# EAGLE design V2.0 (EAGLE 9.6.2)
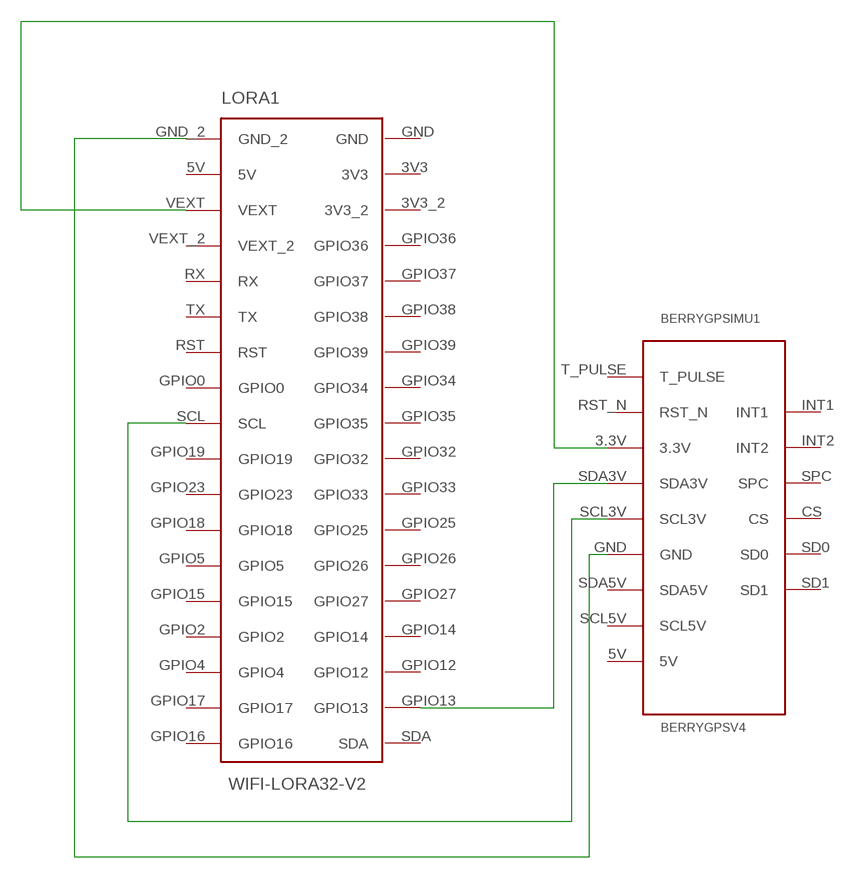
[diagram p0: schematic, sheet 1]

## Parts
BERRYGPSIMU1  BERRYGPSV4  [BERRYGPSV4]
LORA1  WIFI-LORA32-V2  [WIFI-LORA32-V2]

## Nets
N$1: BERRYGPSIMU1.SDA3V LORA1.GPIO13
N$2: BERRYGPSIMU1.SCL3V LORA1.SCL
N$3: BERRYGPSIMU1.GND LORA1.GND_2
N$4: BERRYGPSIMU1.3.3V LORA1.VEXT
Unconnected: BERRYGPSIMU1.5V BERRYGPSIMU1.CS BERRYGPSIMU1.INT1 BERRYGPSIMU1.INT2 BERRYGPSIMU1.RST_N BERRYGPSIMU1.SCL5V BERRYGPSIMU1.SD0 BERRYGPSIMU1.SD1 BERRYGPSIMU1.SDA5V BERRYGPSIMU1.SPC BERRYGPSIMU1.T_PULSE LORA1.3V3 LORA1.3V3_2 LORA1.5V LORA1.GND LORA1.GPIO0 LORA1.GPIO2 LORA1.GPIO4 LORA1.GPIO5 LORA1.GPIO12 LORA1.GPIO14 LORA1.GPIO15 LORA1.GPIO16 LORA1.GPIO17 LORA1.GPIO18 LORA1.GPIO19 LORA1.GPIO23 LORA1.GPIO25 LORA1.GPIO26 LORA1.GPIO27 LORA1.GPIO32 LORA1.GPIO33 LORA1.GPIO34 LORA1.GPIO35 LORA1.GPIO36 LORA1.GPIO37 LORA1.GPIO38 LORA1.GPIO39 LORA1.RST LORA1.RX LORA1.SDA LORA1.TX LORA1.VEXT_2

## Library data of the parts
BERRYGPSIMU1 = berrygpsv4:BERRYGPSV4: BerryGPS-IMU v4 has been designed to fit perfectly with the Raspberry Pi Zero. It is also compatible with all other versions of the Raspberry Pi and Arduino.
LORA1 = wifilora32v2:WIFI-LORA32-V2

## Board
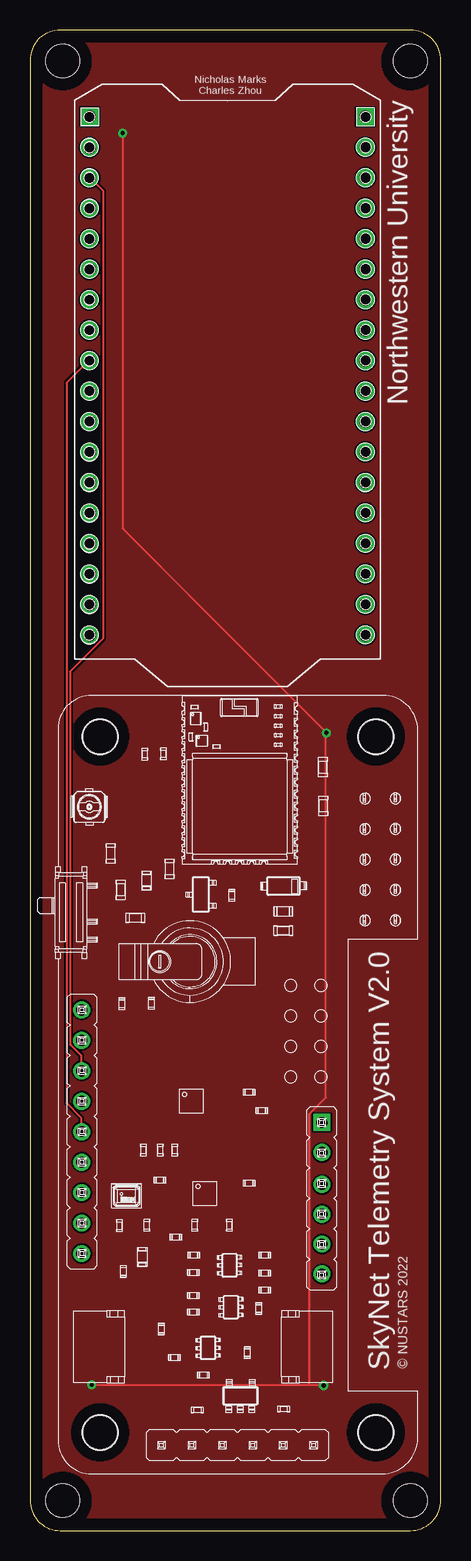
[diagram p1: board, top side]
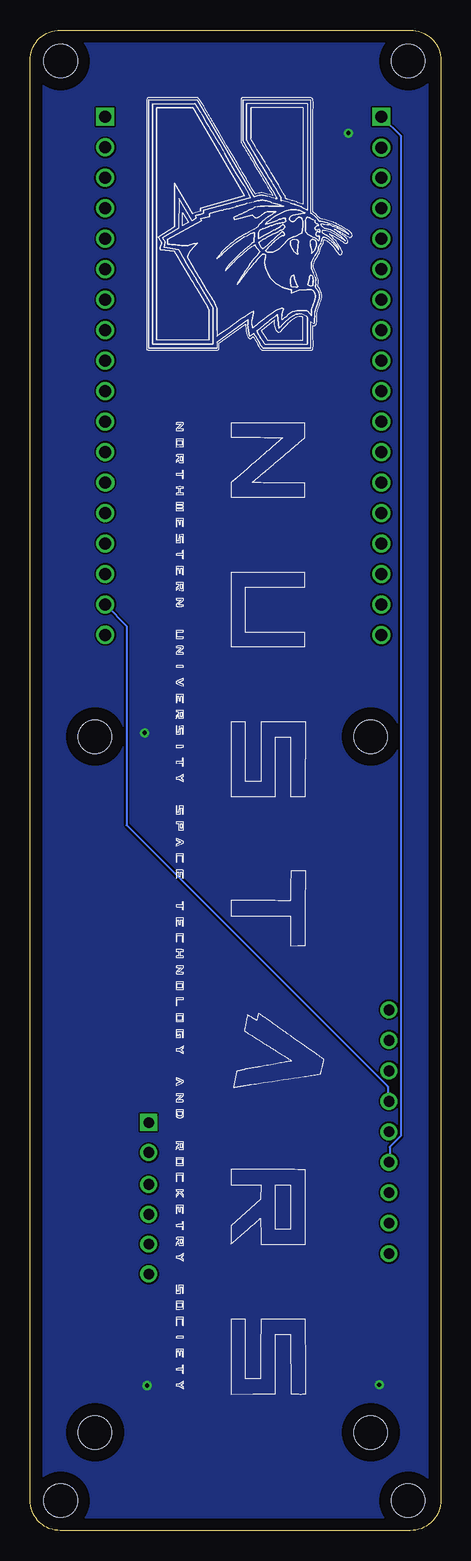
[diagram p2: board, bottom side, seen from below]

Size 34.27 x 125.09 mm. Coordinates in mm from the lower left corner, seen from the top.
Outline: 0,122.55 0,2.54 arc90 2.54,0 31.73,0 arc90 34.27,2.54 34.27,122.55 arc90 31.73,125.09 2.54,125.09 arc90 0,122.55
Copper layers (1*16): Top 0.035mm / dielectric 1.5mm / Bottom 0.035mm
Design rules "default": minimum track width 6mil, minimum drill 0.35mm, track to track 6mil, track to pad 6mil, pad to pad 6mil, via to via 6mil, smd to smd 6mil, copper to edge 40mil, drill to drill 6mil, minimum pad ring 10mil, minimum via ring 8mil, stop-mask expansion 4mil, vias tented up to drill 0mil, thermal gap 10mil
Holes 2.8 mm at 5.85,66.18 28.85,66.18 5.85,8.18 28.85,8.18 2.72,2.5 31.72,2.5 2.72,122.5 31.72,122.5

### Footprints (pad centres in the part's own frame; a part is rotated, then mirrored left to right if it is on the bottom)
BERRYGPSV4 = drill 0.9: 3.3V 137.668,-50.8; 5V 137.668,-66.04; CS 157.709,-62.763; GND 137.668,-58.42; INT2 157.709,-57.607; RST_N 137.668,-48.26; SCL3V 137.668,-55.88; SCL5V 137.668,-63.5; SD0 157.709,-65.253; SD1 157.709,-67.742; SDA3V 137.668,-53.34; SDA5V 137.668,-60.96; SPC 157.709,-60.274; T_PULSE 137.668,-45.72 | drill 0.9 square: INT1 157.709,-55.118
WIFI-LORA32-V2 = drill 1 pad 1.5: 3V3 -17.808,10.766; 3V3_2 -15.276,10.772; 5V -17.794,-12.254; GPIO0 -2.559,-12.253; GPIO2 15.223,-12.256; GPIO4 17.762,-12.257; GPIO5 10.141,-12.258; GPIO12 17.748,10.763; GPIO13 20.29,10.764; GPIO14 15.209,10.764; GPIO15 12.684,-12.254; GPIO16 22.841,-12.257; GPIO17 20.304,-12.256; GPIO18 7.598,-12.256; GPIO19 2.519,-12.256; GPIO23 5.061,-12.255; GPIO25 7.584,10.764; GPIO26 10.127,10.762; GPIO27 12.67,10.766; GPIO32 2.505,10.764; GPIO33 5.047,10.765; GPIO34 -2.573,10.767; GPIO35 -0.034,10.765; GPIO36 -12.737,10.769; GPIO37 -10.194,10.764; GPIO38 -7.656,10.765; GPIO39 -5.116,10.763; RST -5.102,-12.257; RX -10.18,-12.256; SCL -0.02,-12.255; SDA 22.827,10.763; TX -7.642,-12.255; VEXT -15.262,-12.248; VEXT_2 -12.723,-12.251 | drill 1 pad 1.5 square: GND -20.359,10.764; GND_2 -20.345,-12.256

### Placement (x,y rotation side)
BERRYGPSIMU1  -133.35,89.13 0 top
LORA1  17.22,97.5 270 top

### Tracks (layer width: path | path; a pad name or v marks a point on that pad's centre or on a via)
GND  (via drill 0.35)
  Top 0.152: 23.32,12.17 5.18,12.17 v5.14,12.16 | 23.32,12.17 24.38,12.17 v24.5,12.09 | 23.32,12.17 23.32,34.72 24.69,36.09 24.69,66.42 v24.72,66.5 24.69,66.58 7.77,83.49 7.77,116.41 v7.72,116.5
  pour Top: -6.78,129 -6.78,-5.5 -3.28,-9 46.72,-9 46.72,125 42.22,129.5 -5.78,129.5 -6.28,129
  pour Bottom: -2.28,133 -4.78,130.5 -4.78,-8 -4.28,-7.5 42.22,-7.5 48.72,-1 48.72,131 46.72,133
N$1
  Bottom 0.152: BERRYGPSIMU1.SDA3V 4.42,35.79 4.42,37.01 26.21,58.8 26.21,75.41 27.89,77.09 LORA1.GPIO13
N$2
  Top 0.152: BERRYGPSIMU1.SCL3V 4.27,33.35 4.27,34.42 3.05,35.64 3.05,95.68 4.88,97.51 LORA1.SCL
N$3
  Bottom 0.152: BERRYGPSIMU1.GND 4.27,30.76 4.27,31.98 3.35,32.89 3.35,116.26 4.88,117.78 LORA1.GND_2
N$4
  Top 0.152: BERRYGPSIMU1.3.3V 4.27,38.38 4.27,39.6 3.35,40.51 3.35,71.6 6.1,74.35 6.1,111.69 5.03,112.75 LORA1.VEXT

### Text on the board
tPlace: Nicholas Marks / Charles Zhou | Northwestern University | SkyNet Telemetry System V2.0 | © NUSTARS 2022